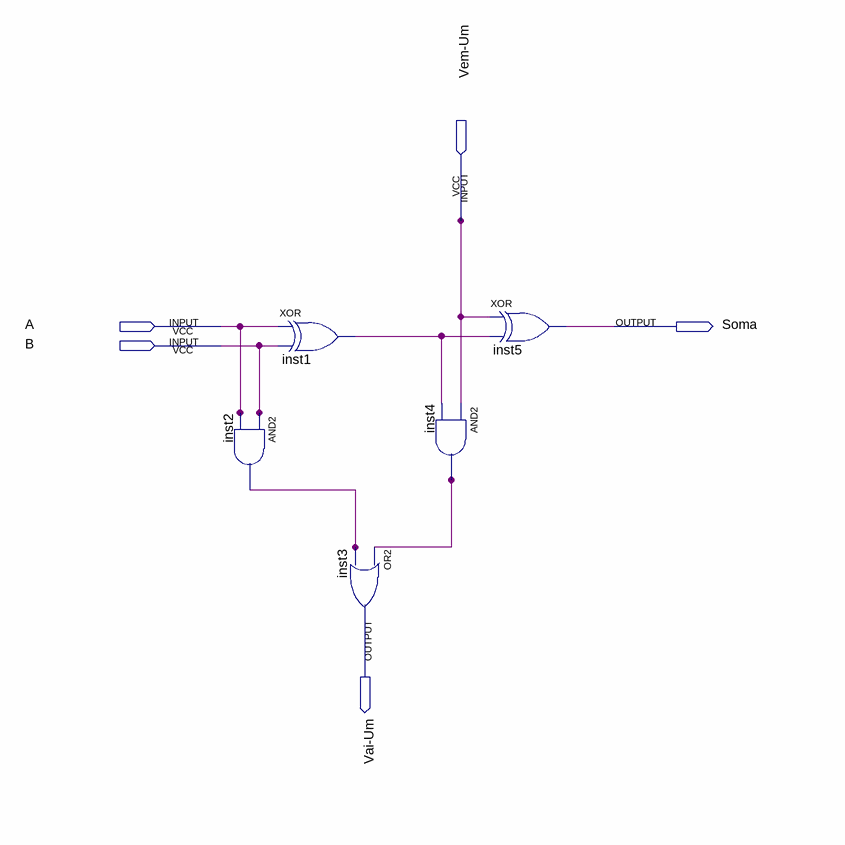
[diagram p0: schematic sheet]
// Quartus schematic full_adder_1bit.bdf as structural Verilog: 5 symbols, 5 pins
module full_adder_1bit (
  input  \Vem-Um ,
  input  A,
  input  B,
  output Soma,
  output \Vai-Um 
);

  wire inst1_out, inst2_out, inst4_out;

  and inst2 (inst2_out, B, A);
  xor inst1 (inst1_out, A, B);
  // OR2 inst3 has open pins: IN1=inst4_out, IN2=inst2_out, OUT=open
  and inst4 (inst4_out, \Vem-Um , inst1_out);
  xor inst5 (Soma, \Vem-Um , inst1_out);
endmodule
